# EAGLE design untitled (EAGLE 5.12)
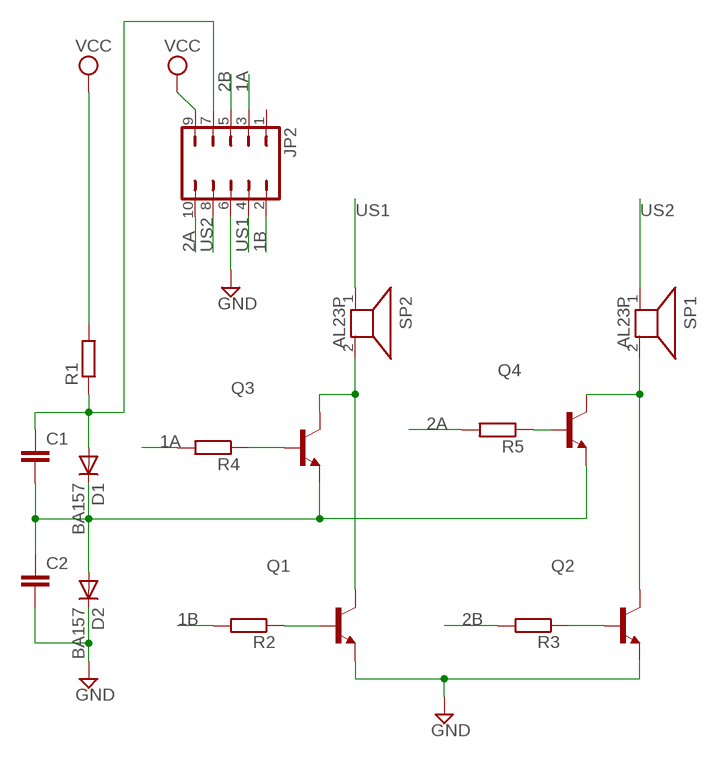
[diagram p0: schematic, sheet 1]

## Parts
C1  C5/2.5  [C5B2.5]
C2  C5/2.5  [C5B2.5]
D1  BA157  [P1-10]
D2  BA157  [P1-10]
JP2  JP5Q  [JP5Q]
Q1  BC847  [SOT23]
Q2  BC847  [SOT23]
Q3  BC847  [SOT23]
Q4  BC847  [SOT23]
R1  R-EU_M1206  [M1206]
R2  R-EU_M1206  [M1206]
R3  R-EU_M1206  [M1206]
R4  R-EU_M1206  [M1206]
R5  R-EU_M1206  [M1206]
SP1  AL23P  [AL23P]
SP2  AL23P  [AL23P]

## Nets
1A: JP2.3 R4.2
1B: JP2.2 R2.2
2A: JP2.10 R5.2
2B: JP2.5 R3.2
GND: C2.2 D2.C JP2.6 Q1.2(E) Q2.2(E)
N$1: C1.1 D1.A JP2.7 R1.1
N$3: C1.2 C2.1 D1.C D2.A Q3.2(E) Q4.2(E)
N$7: Q2.1(B) R3.1
N$8: Q1.1(B) R2.1
N$9: Q1.3(C) Q3.3(C) SP2.2
N$10: Q2.3(C) Q4.3(C) SP1.2
N$11: Q3.1(B) R4.1
N$13: Q4.1(B) R5.1
US1: JP2.4 SP2.1
US2: JP2.8 SP1.1
VCC: JP2.9 R1.2
Unconnected: JP2.1

## Library data of the parts
C1 C2 = capacitor-wima:C: CAPACITOR naming: grid - package width
D1 D2 = diode:BA157: DIODE fast soft-recovery controlled avalanche rectifier
JP2 = jumper:JP5Q: JUMPER
Q1-Q4 = transistor-neu-to92:BC847: NPN TRANSISTOR
R1-R5 = rcl:R-EU_: RESISTOR, European symbol
SP1 SP2 = buzzer:AL23P: SPEAKER Source: Buerklin; OC_FARNELL: unknown; OC_NEWARK: unknown

## Board
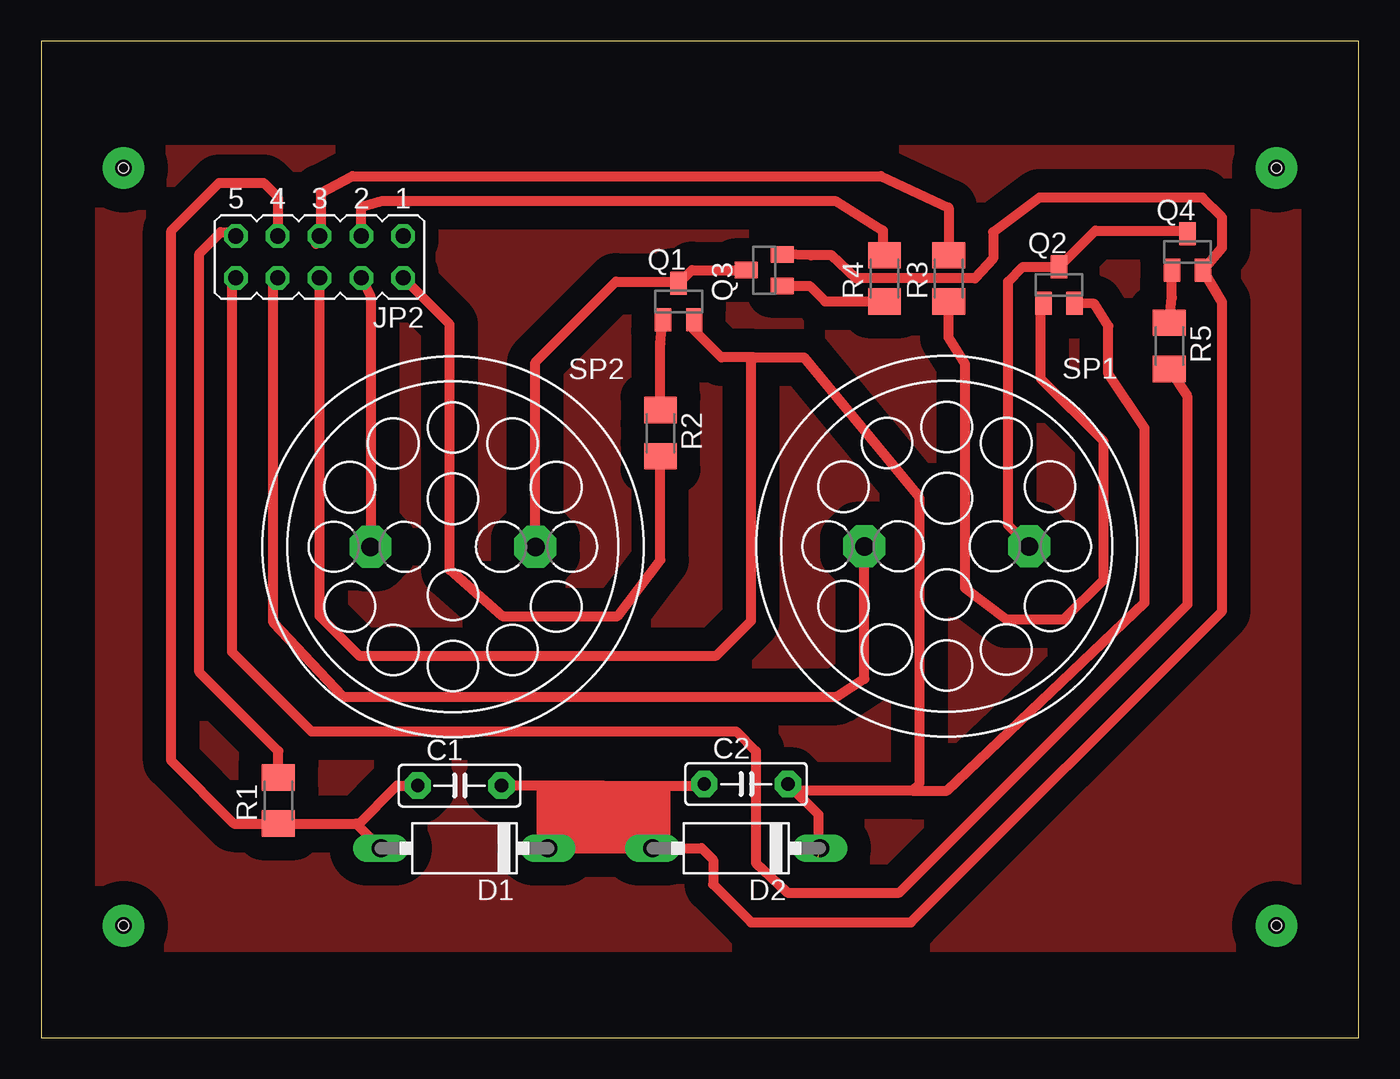
[diagram p1: board, top side]

Size 80 x 60.5 mm. Coordinates in mm from the lower left corner, seen from the top.
Outline: 0,0 80,0 80,60.5 0,60.5 0,0
Copper layers (1*16): Top 0.035mm / dielectric 1.5mm / Bottom 0.035mm
Design rules "default": minimum track width 10mil, minimum drill 24mil, track to track 8mil, track to pad 8mil, pad to pad 8mil, via to via 8mil, smd to smd 8mil, copper to edge 40mil, drill to drill 8mil, minimum pad ring 10mil, minimum via ring 8mil, stop-mask expansion 4mil, vias tented up to drill 0mil, thermal gap 10mil
Holes 0.6 mm at 5,52.8 75,52.8 5,6.8 75,6.8

### Footprints (pad centres in the part's own frame; a part is rotated, then mirrored left to right if it is on the bottom)
C5B2.5 = drill 0.813 pad 1.6 octagon: 1 -2.54,0; 2 2.54,0
P1-10 = drill 1.118 long: A 5.08,0; C -5.08,0
JP5Q = drill 0.914 octagon: 1 -5.08,-1.27; 2 -5.08,1.27; 3 -2.54,-1.27; 4 -2.54,1.27; 5 0,-1.27; 6 0,1.27; 7 2.54,-1.27; 8 2.54,1.27; 9 5.08,-1.27; 10 5.08,1.27
SOT23 = smd 1 x 1.4: 1 -0.95,-1.1; 2 0.95,-1.1; 3 0,1.1
M1206 = smd 1.6 x 2: 1 -1.4,0; 2 1.4,0
AL23P = drill 1.118 pad 2.54 octagon: 1 -5.004,0; 2 5.004,0

### Placement (x,y rotation side)
C1  25.4,15.3 0 top
C2  42.8,15.4 0 top
D1  25.7,11.5 180 top
D2  42.2,11.5 180 top
JP2  16.9,47.4 180 top
Q1  38.7,44.7 0 top
Q2  61.8,45.7 0 top
Q3  43.9,46.6 90 top
Q4  69.6,47.7 0 top
R1  14.4,14.4 90 top
R2  37.6,36.7 270 top
R3  55.1,46.1 90 top
R4  51.2,46.1 90 top
R5  68.5,42 270 top
SP1  54.98,29.83 0 top
SP2  25,29.8 0 top

### Tracks (layer width: path | path; a pad name or v marks a point on that pad's centre or on a via)
1A
  Top 0.61: 51.1,47.4 51.1,49 48.2,50.8 20.7,50.8 19.44,50.44 JP2.3 | 51.1,47.4 50.8,47.1 | 51.1,47.4 R4.2
1B
  Top 0.61: JP2.2 24.8,43.31 24.8,28.4 28,25.6 35,25.6 37.6,29 R2.2
2A
  Top 0.61: R5.2 69.6,38.9 69.6,26.3 52.1,8.8 45.3,8.8 45.2,8.9 43.4,10.6 43.4,17.4 42.2,18.6 16.4,18.6 11.6,23.4 11.6,45.91 JP2.10
2B
  Top 0.61: JP2.5 16.7,48.47 16.7,48.2 17,48.5 17,51.3 18.9,52.3 51,52.3 55.1,50.4 R3.2
GND  (1 unrouted)
  Top 0.61: Q2.2 63.95,44.55 64.8,43.2 64.8,40.3 67,37 67,26.4 55,15 52.9,15 | 43.3,41.3 46.3,41.3 53.3,32.8 53.3,15.4 52.9,15 | 43.3,41.3 41.3,41.3 39.65,42.95 Q1.2 | JP2.6 16.9,25.6 19.3,23.2 41,23.2 43.1,25.3 43.1,41.1 43.3,41.3 | 52.9,15 45.74,15 C2.2 47.18,13.56 47.18,10.96
N$1
  Top 0.61: JP2.7 14.36,51.04 13.5,51.9 10.8,51.9 7.9,49 7.9,16.8 11.7,13 R1.1 19.12,13 19.21,12.91 | 19.21,12.91 D1.A | C1.1 21.6,15.3 19.21,12.91
N$2  (via drill 1 pad 2.54)
  other vias: 75,52.8
N$3
  Top 0.61: Q3.2 46.75,47.5 48,47.5 49.5,46.1 56.7,46.1 57.8,47.3 57.8,48.9 60.6,51 70.5,51 71.7,49.8 71.7,47.95 Q4.2 71.7,44.65 71.7,25.9 52.8,7 43.1,7 40.8,9.3 40.8,10.8 40.1,11.5 D2.A 34.1,11.5 | D1.C 34.1,11.5 | 34.1,15.3 C1.2 | C2.1 40.16,15.3 34.1,15.3 | 34.1,11.5 34.1,15.3
N$4  (via drill 1 pad 2.54)
  other vias: 75,6.8
N$5  (via drill 1 pad 2.54)
  other vias: 5,6.8
N$6  (via drill 1 pad 2.54)
  other vias: 5,52.8
N$7
  Top 0.61: Q2.1 60.7,44.45 60.7,40 64.5,36.2 64.5,27.8 62.1,25.4 58.6,25.4 56.1,27.3 56.1,40.9 55.1,42.5 R3.1
N$8
  Top 0.61: R2.1 37.6,42.15 Q1.1
N$9
  Top 0.61: SP2.2 30,41 34.9,45.9 38.6,45.9 Q1.3 39.5,46.6 Q3.3
N$10
  Top 0.61: Q4.3 69.4,49 64,49 Q2.3 59.6,46.8 58.7,45.9 58.7,31.11 SP1.2
N$11
  Top 0.61: Q3.1 46.65,45.65 47.6,44.7 R4.1
N$13
  Top 0.61: Q4.1 68.65,44.95 R5.1
N$15
  pour Top (isolate 1.422): 4,53.9 76.2,53.9 76.2,5.5 3.6,5.5 3.6,53.7
US1
  Top 0.61: JP2.4 20,44.97 SP2.1
US2
  Top 0.61: JP2.8 14.1,45.87 14.1,25.2 18.3,20.7 48.3,20.7 49.98,21.78 SP1.1
VCC
  Top 0.61: R1.2 14.4,17.4 9.6,22.2 9.6,47.6 10.9,48.9 11.59,48.9 JP2.9 11.69,48.8
(copper drawn outside any net)
  shapes: Top area x1